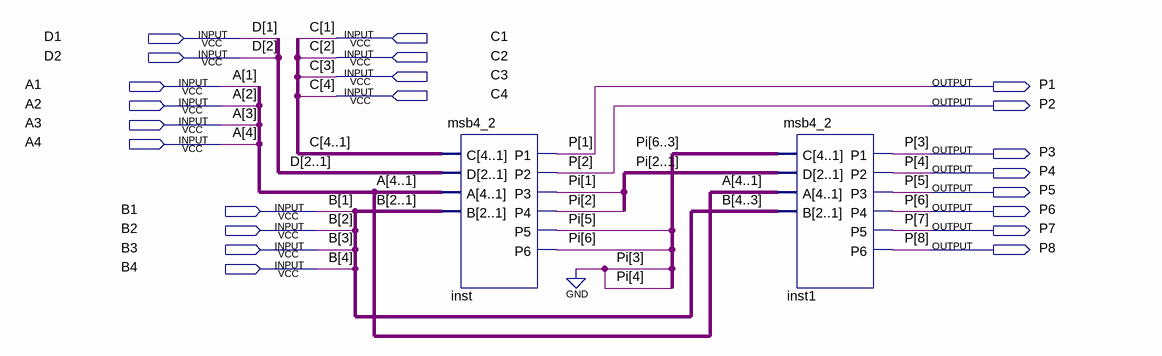
[diagram p0: schematic sheet]
// Quartus schematic msb4_4.bdf as structural Verilog: 2 symbols, 22 pins
module msb4_4 (
  input  D1,
  input  C1,
  input  D2,
  input  C2,
  input  C3,
  input  A1,
  input  C4,
  input  A2,
  input  A3,
  input  A4,
  input  B1,
  input  B2,
  input  B3,
  input  B4,
  output P1,
  output P2,
  output P3,
  output P4,
  output P5,
  output P6,
  output P7,
  output P8
);

  wire [6:1] Pi;

  msb4_2 inst (
    .C({C4, C3, C2, C1}), .D({D2, D1}), .A({A4, A3, A2, A1}), .B({B2, B1}), .P1(P1), .P2(P2), .P3(Pi[1]),
    .P4(Pi[2]), .P5(Pi[5]), .P6(Pi[6]));
  msb4_2 inst1 (
    .C({Pi[6:5], 2'b00}), .D(Pi[2:1]), .A({A4, A3, A2, A1}), .B({B4, B3}), .P1(P3), .P2(P4), .P3(P5),
    .P4(P6), .P5(P7), .P6(P8));
endmodule
